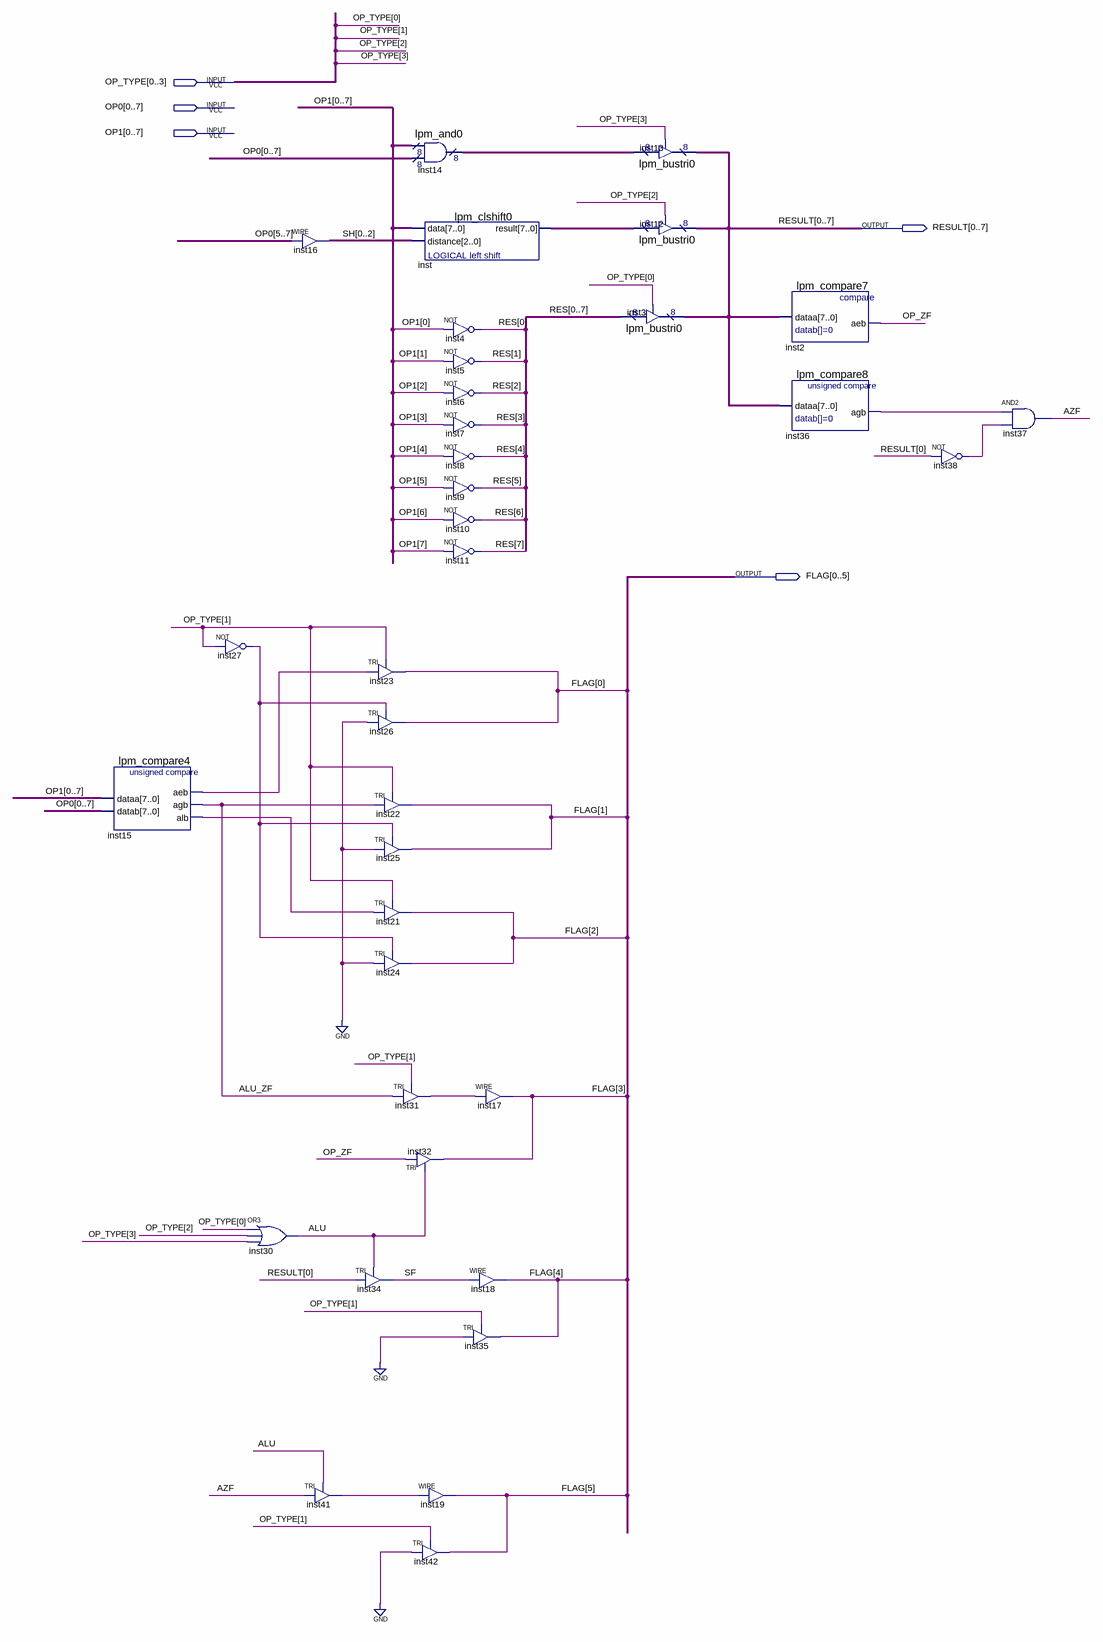
[diagram p0: schematic sheet]
// Quartus schematic ALU.bdf as structural Verilog: 36 symbols, 5 pins
module ALU (
  input  [0:3] OP_TYPE,
  input  [0:7] OP0,
  input  [0:7] OP1,
  output [0:7] RESULT,
  output [0:5] FLAG
);

  wire ALU, ALU_ZF, AZF, inst15_aeb, inst15_alb, inst27_out, inst31_out, inst36_agb, inst38_out, inst41_out,
       OP_ZF, SF;
  wire [2:0] SH;
  wire [7:0] inst14_result, inst_result, RES;

  lpm_compare4 inst15 (.dataa(OP1), .datab(OP0), .aeb(inst15_aeb), .agb(ALU_ZF), .alb(inst15_alb));
  not inst27 (inst27_out, OP_TYPE[1]);
  or inst30 (ALU, OP_TYPE[0], OP_TYPE[2], OP_TYPE[3]);
  assign {SH[0], SH[1], SH[2]} = OP0[5:7];  // WIRE inst16
  TRI inst41 (.IN(AZF), .OE(ALU), .OUT(inst41_out));
  TRI inst23 (.IN(inst15_aeb), .OE(OP_TYPE[1]), .OUT(FLAG[0]));
  TRI inst26 (.IN(1'b0), .OE(inst27_out), .OUT(FLAG[0]));
  TRI inst22 (.IN(ALU_ZF), .OE(OP_TYPE[1]), .OUT(FLAG[1]));
  TRI inst25 (.IN(1'b0), .OE(inst27_out), .OUT(FLAG[1]));
  TRI inst21 (.IN(inst15_alb), .OE(OP_TYPE[1]), .OUT(FLAG[2]));
  TRI inst24 (.IN(1'b0), .OE(inst27_out), .OUT(FLAG[2]));
  TRI inst31 (.IN(ALU_ZF), .OE(OP_TYPE[1]), .OUT(inst31_out));
  TRI inst34 (.IN(RESULT[0]), .OE(ALU), .OUT(SF));
  lpm_and0 inst14 (.data0x(OP1), .data1x(OP0), .result(inst14_result));
  lpm_clshift0 inst (.data(OP1), .distance({SH[0], SH[1], SH[2]}), .result(inst_result));
  not inst4 (RES[0], OP1[0]);
  not inst5 (RES[1], OP1[1]);
  not inst6 (RES[2], OP1[2]);
  not inst7 (RES[3], OP1[3]);
  not inst8 (RES[4], OP1[4]);
  not inst9 (RES[5], OP1[5]);
  not inst10 (RES[6], OP1[6]);
  not inst11 (RES[7], OP1[7]);
  TRI inst32 (.IN(OP_ZF), .OE(ALU), .OUT(FLAG[3]));
  assign FLAG[5] = inst41_out;  // WIRE inst19
  TRI inst42 (.IN(1'b0), .OE(OP_TYPE[1]), .OUT(FLAG[5]));
  assign FLAG[3] = inst31_out;  // WIRE inst17
  assign FLAG[4] = SF;  // WIRE inst18
  TRI inst35 (.IN(1'b0), .OE(OP_TYPE[1]), .OUT(FLAG[4]));
  lpm_bustri0 inst13 (.enabledt(OP_TYPE[3]), .data(inst14_result), .tridata(RESULT));
  lpm_bustri0 inst12 (.enabledt(OP_TYPE[2]), .data(inst_result), .tridata(RESULT));
  lpm_bustri0 inst3 (
    .enabledt(OP_TYPE[0]), .data({RES[0], RES[1], RES[2], RES[3], RES[4], RES[5], RES[6], RES[7]}),
    .tridata(RESULT));
  lpm_compare7 inst2 (.dataa(RESULT), .aeb(OP_ZF));
  lpm_compare8 inst36 (.dataa(RESULT), .agb(inst36_agb));
  not inst38 (inst38_out, RESULT[0]);
  and inst37 (AZF, inst36_agb, inst38_out);
endmodule
